# EAGLE schematic main_brd (EAGLE 9.2.2)
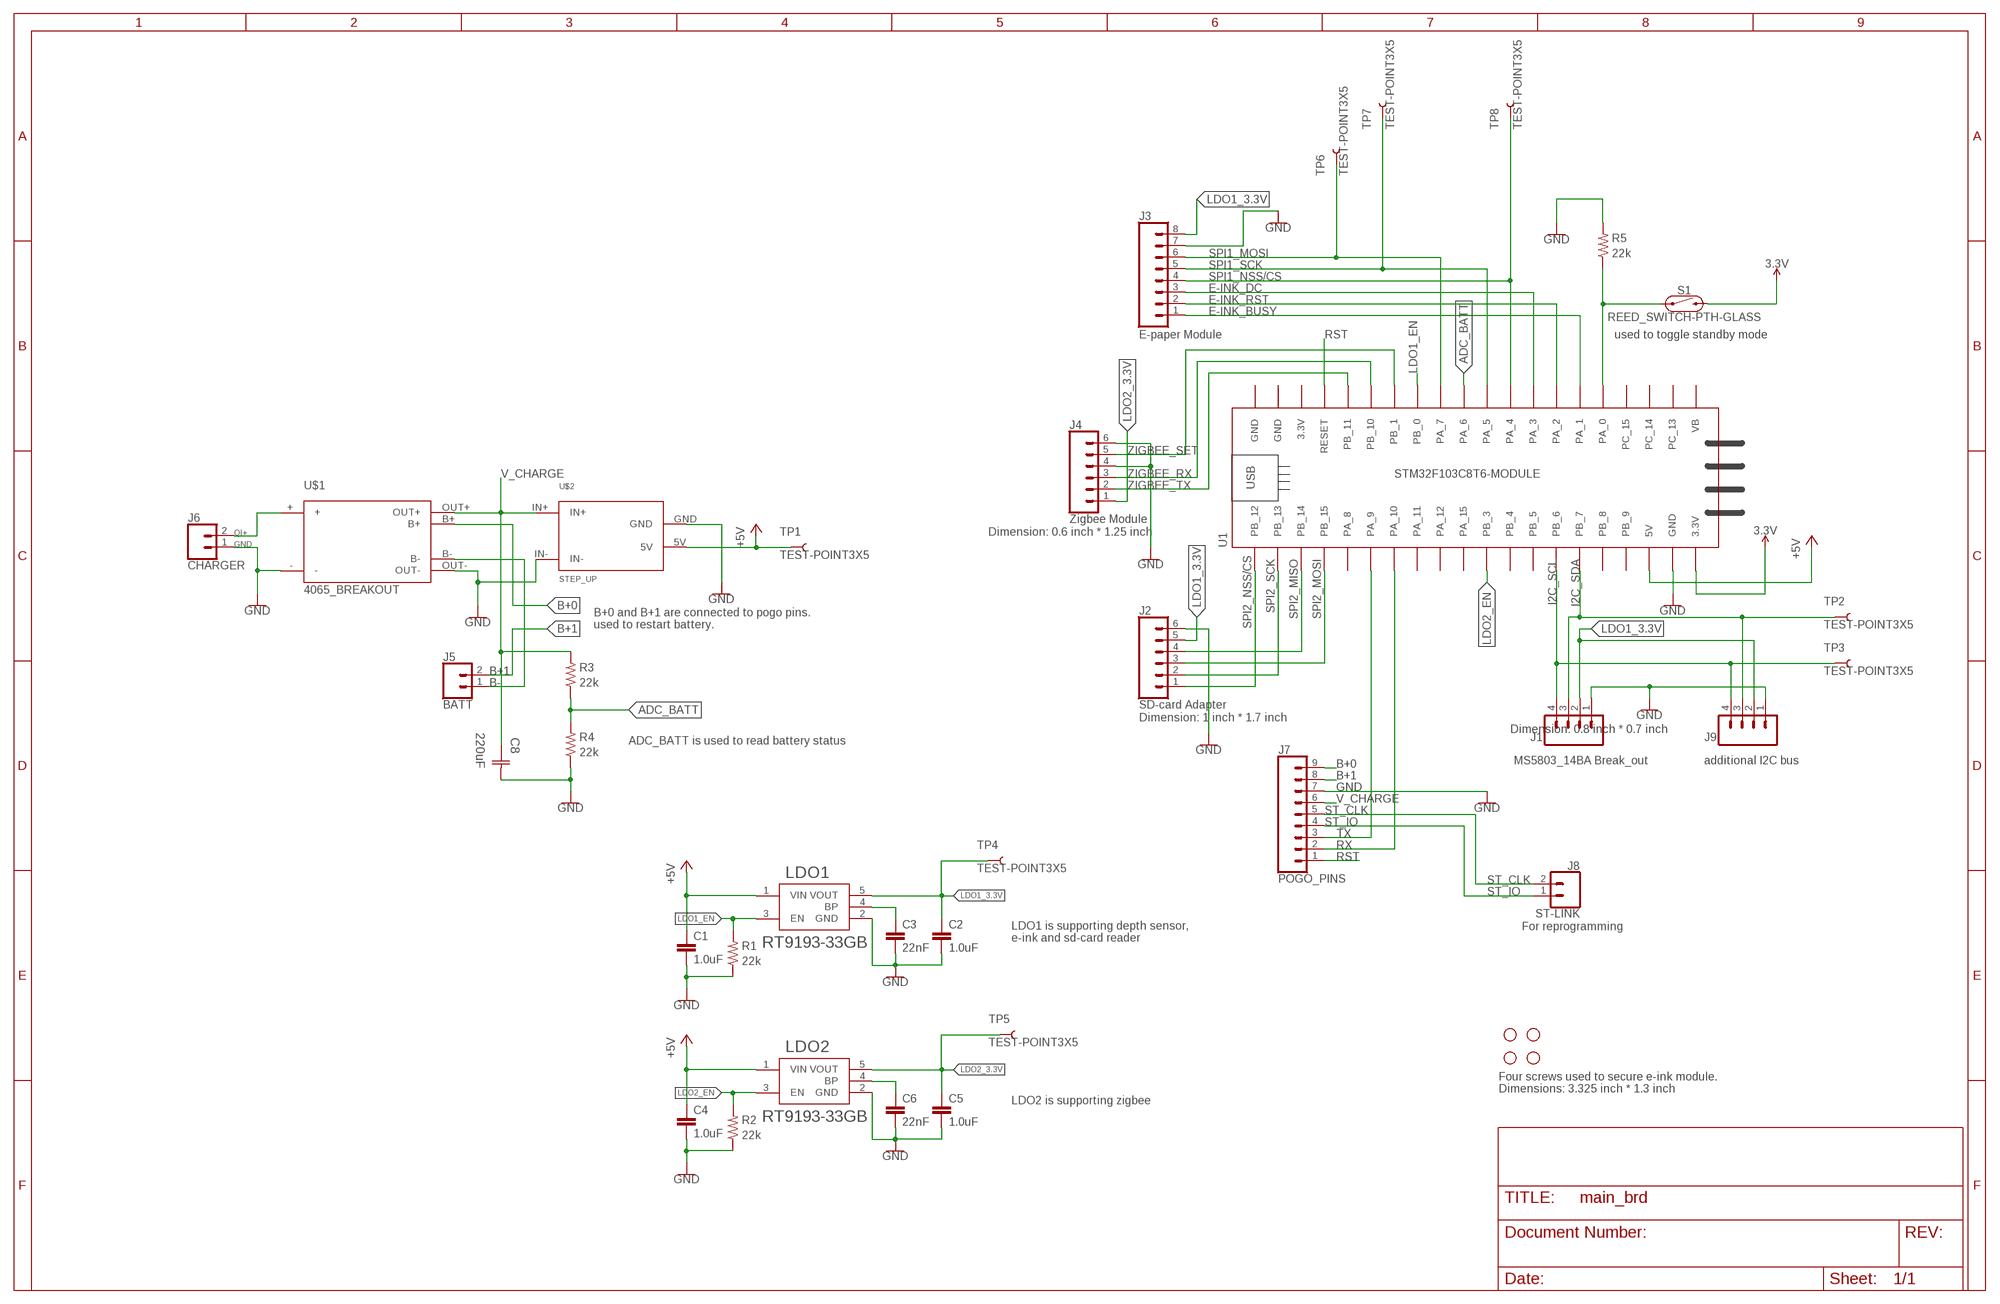
[diagram p0: schematic, sheet 1]

## Parts
C1  1.0uF  1.0UF-0603-16V-10%-X7R  [0603]
C2  1.0uF  1.0UF-0603-16V-10%-X7R  [0603]
C3  22nF  22NF/22,000PF-0603-50V-10%  [0603]
C4  1.0uF  1.0UF-0603-16V-10%-X7R  [0603]
C5  1.0uF  1.0UF-0603-16V-10%-X7R  [0603]
C6  22nF  22NF/22,000PF-0603-50V-10%  [0603]
C8  UWT1C221MCL1GSU2-K-M  [U2-K-M]
H1  STAND-OFFTIGHT  [STAND-OFF-TIGHT]
H2  STAND-OFFTIGHT  [STAND-OFF-TIGHT]
H3  STAND-OFFTIGHT  [STAND-OFF-TIGHT]
H4  STAND-OFFTIGHT  [STAND-OFF-TIGHT]
J1  MS5803_14BA Break_out  CONN_04PTH  [1X04]
J2  SD-card Adapter  CONN_06SILK_FEMALE_PTH  [1X06]
J3  E-paper Module  CONN_08"  [1X08]
J4  Zigbee Module  CONN_06SILK_FEMALE_PTH  [1X06]
J5  BATT  CONN_02  [1X02]
J6  CHARGER  CONN_02  [1X02]
J7  POGO_PINS  CONN_09  [1X09]
J8  ST-LINK  CONN_02  [1X02]
J9  additional I2C bus  CONN_04PTH  [1X04]
LDO1  RT9193-33GB  [SOT94P279X129-5N]
LDO2  RT9193-33GB  [SOT94P279X129-5N]
R1  22k  22KOHM-0603-1/10W-1%  [0603]
R2  22k  22KOHM-0603-1/10W-1%  [0603]
R3  22k  22KOHM-0603-1/10W-1%  [0603]
R4  22k  22KOHM-0603-1/10W-1%  [0603]
R5  22k  22KOHM-0603-1/10W-1%  [0603]
S1  REED_SWITCH-PTH-GLASS  [REED_SWITCH_GLASS]
TP1  TEST-POINT3X5  [PAD.03X.05]
TP2  TEST-POINT3X5  [PAD.03X.05]
TP3  TEST-POINT3X5  [PAD.03X.05]
TP4  TEST-POINT3X5  [PAD.03X.05]
TP5  TEST-POINT3X5  [PAD.03X.05]
TP6  TEST-POINT3X5  [PAD.03X.05]
TP7  TEST-POINT3X5  [PAD.03X.05]
TP8  TEST-POINT3X5  [PAD.03X.05]
U1  STM32F103C8T6-MODULE  [STM32F103C8T6-MODULE]
U$1  4065_BREAKOUT  [CHARGE_MODULE]
U$2  STEP_UP  [STEP_UP_99_69]

## Nets
3.3V: S1.P$2 U1.3.3V_1(3.3V)
+5V: C1.1 C4.1 LDO1.1(VIN) LDO2.1(VIN) TP1.P$1 U1.5V U$2.5V
ADC_BATT: R3.1 R4.2 U1.PA_6
B+0: J7.9 U$1.B+
B+1: J5.2 J7.8
B-: J5.1 U$1.B-
E-INK_BUSY: J3.1 U1.PA_1
E-INK_DC: J3.3 U1.PA_3
E-INK_RST: J3.2 U1.PA_2
GND: C1.2 C2.2 C3.2 C4.2 C5.2 C6.2 C8.2 J1.1 J2.6 J3.7 J4.4 J4.6 J6.1 J7.7 J9.1 LDO1.2(GND) LDO2.2(GND) R1.1 R2.1 R4.1 R5.2 U1.GND_1(GND) U$1.- U$1.OUT- U$2.GND U$2.IN-
I2C_SCL: J1.4 J9.4 TP3.P$1 U1.PB_6
I2C_SDA: J1.3 J9.3 TP2.P$1 U1.PB_7
LDO1_3.3V: C2.1 J1.2 J2.5 J3.8 J9.2 LDO1.5(VOUT) TP4.P$1
LDO1_EN: LDO1.3(EN) R1.2 U1.PB_0
LDO2_3.3V: C5.1 J4.1 LDO2.5(VOUT) TP5.P$1
LDO2_EN: LDO2.3(EN) R2.2 U1.PB_3
N$1: C6.1 LDO2.4(BP)
N$2: C3.1 LDO1.4(BP)
N$10: R5.1 S1.P$1 U1.PA_0
QI+: J6.2 U$1.+
RST: J7.1 U1.RESET
RX: J7.2 U1.PA_10
SPI1_MOSI: J3.6 TP6.P$1 U1.PA_7
SPI1_NSS/CS: J3.4 TP8.P$1 U1.PA_4
SPI1_SCK: J3.5 TP7.P$1 U1.PA_5
SPI2_MISO: J2.4 U1.PB_14
SPI2_MOSI: J2.3 U1.PB_15
SPI2_NSS/CS: J2.1 U1.PB_12
SPI2_SCK: J2.2 U1.PB_13
ST_CLK: J7.5 J8.2
ST_IO: J7.4 J8.1
TX: J7.3 U1.PA_9
V_CHARGE: C8.1 J7.6 R3.2 U$1.OUT+ U$2.IN+
ZIGBEE_RX: J4.3 U1.PB_10
ZIGBEE_SET: J4.5 U1.PB_1
ZIGBEE_TX: J4.2 U1.PB_11
Unconnected: U1.3.3V_2(3.3V) U1.GND_2(GND) U1.PA_8 U1.PA_11 U1.PA_12 U1.PA_15 U1.PB_4 U1.PB_5 U1.PB_8 U1.PB_9 U1.PC_13 U1.PC_14 U1.PC_15 U1.VB

## Notes on the sheet
- E-paper Module | used to toggle standby mode
- Dimension: 0.6 inch * 1.25 inch
- B+0 and B+1 are connected to pogo pins.
  used to restart battery.
- Dimension: 1 inch * 1.7 inch
- Dimension: 0.8 inch * 0.7 inch
- ADC_BATT is used to read battery status
- For reprogramming
- LDO1 is supporting depth sensor, 
  e-ink and sd-card reader
- Four screws used to secure e-ink module.
  Dimensions: 3.325 inch * 1.3 inch
- LDO2 is supporting zigbee

## Power pins joined to a net without a drawn wire
GND: U1.GND_3(GND)

## Library data of the parts
C1 C2 C4 C5 = SparkFun-Capacitors:1.0UF: 1µF ceramic capacitors A capacitor is a passive two-terminal electrical component used to store electrical energy temporarily in an electric field.; PROD_ID: CAP-13930
C3 C6 = SparkFun-Capacitors:22NF/22,000PF: 0.022uF/22nF/22,000pF ceramic capacitors A capacitor is a passive two-terminal electrical component used to store electrical energy temporarily in an electric field.; PROD_ID: CAP-07885
C8 = capacitor_220uF:UWT1C221MCL1GS; MANUFACTURER_PART_NUMBER: UWT1C221MCL1GS; VENDOR: Nichicon
H1-H4 = SparkFun-Hardware:STAND-OFF: Stand Off Drill holes for mechanically mounting via screws, standoffs, etc. Note: Use the keepout ring to avoid running the screw head into surrounding components. Variant Overviews STAND-OFF - Mechanical footprint for a #4 phillips button head screw. STAND-OFF-TIGHT - Mechanical footprint for a #4 phillips button head screw, Example SparkFun Products Screw - Phillips Head (1/4", 4-40, 10 pack) <https://www.sparkfun.com/products/10453> (PRT-10453) Screw - Phillips Head (1/2", 4-40, 10 pack) <https://www.sparkfun.com/products/10452> (PRT-10452) Screw - Phillips Head (3/4", 4-40, 10 pack) <https://www.sparkfun.com/products/10451> (PRT-10451) Screw - Phillips Head (1", 4-40, 10 pack) <https://www.sparkfun.com/products/10450> (PRT-10450)
J1 J9 = SparkFun-Connectors:CONN_04: Multi connection point. Often used as Generic Header-pin footprint for 0.1 inch spaced/style header connections On any of the 0.1 inch spaced packages, you can populate with these: Break Away Headers - Straight <https://www.sparkfun.com/products/116> (PRT-00116) Break Away Male Headers - Right Angle <https://www.sparkfun.com/products/553> (PRT-00553) Female Headers <https://www.sparkfun.com/products/115> (PRT-00115) Break Away Headers - Machine Pin <https://www.sparkfun.com/products/117> (PRT-00117) Break Away Female Headers - Swiss Machine Pin <https://www.sparkfun.com/products/743> (PRT-00743) For SCREWTERMINALS and SPRING TERMINALS visit here: Screw Terimnals on SparkFun.com <https://www.sparkfun.com/search/results?term=Screw+Terminals> (5mm/3.5mm/2.54mm spacing) This device is also useful as a general connection point to wire up your design to another part of your project. Our various solder wires solder well into these plated through hole pads. Hook-Up Wire - Assortment (Stranded, 22 AWG) <https://www.sparkfun.com/products/11375> (PRT-11375) Hook-Up Wire - Assortment (Solid Core, 22 AWG) <https://www.sparkfun.com/products/11367> (PRT-11367) View the entire wire category on our website here <https://www.sparkfun.com/categories/141> Special notes: Molex polarized connector foot print use with SKU : PRT-08231 with associated crimp pins and housings. 1MM SMD Version SKU: PRT-10208; PROD_ID: CONN-09696
J2 J4 = SparkFun-Connectors:CONN_06: Multi connection point. Often used as Generic Header-pin footprint for 0.1 inch spaced/style header connections On any of the 0.1 inch spaced packages, you can populate with these: Break Away Headers - Straight <https://www.sparkfun.com/products/116> (PRT-00116) Break Away Male Headers - Right Angle <https://www.sparkfun.com/products/553> (PRT-00553) Female Headers <https://www.sparkfun.com/products/115> (PRT-00115) Break Away Headers - Machine Pin <https://www.sparkfun.com/products/117> (PRT-00117) Break Away Female Headers - Swiss Machine Pin <https://www.sparkfun.com/products/743> (PRT-00743) Arduino Stackable Header - 6 Pin <https://www.sparkfun.com/products/9280> (PRT-09280) For SCREWTERMINALS and SPRING TERMINALS visit here: Screw Terimnals on SparkFun.com <https://www.sparkfun.com/search/results?term=Screw+Terminals> (5mm/3.5mm/2.54mm spacing) This device is also useful as a general connection point to wire up your design to another part of your project. Our various solder wires solder well into these plated through hole pads. Hook-Up Wire - Assortment (Stranded, 22 AWG) <https://www.sparkfun.com/products/11375> (PRT-11375) Hook-Up Wire - Assortment (Solid Core, 22 AWG) <https://www.sparkfun.com/products/11367> (PRT-11367) View the entire wire category on our website here <https://www.sparkfun.com/categories/141>; PROD_ID: CONN-08437
J3 = SparkFun-Connectors:CONN_08: Multi connection point. Often used as Generic Header-pin footprint for 0.1 inch spaced/style header connections On any of the 0.1 inch spaced packages, you can populate with these: Break Away Headers - Straight <https://www.sparkfun.com/products/116> (PRT-00116) Break Away Male Headers - Right Angle <https://www.sparkfun.com/products/553> (PRT-00553) Female Headers <https://www.sparkfun.com/products/115> (PRT-00115) Break Away Headers - Machine Pin <https://www.sparkfun.com/products/117> (PRT-00117) Break Away Female Headers - Swiss Machine Pin <https://www.sparkfun.com/products/743> (PRT-00743) Arduino Stackable Header - 8 Pin <https://www.sparkfun.com/products/9279> (PRT-09279) For SCREWTERMINALS and SPRING TERMINALS visit here: Screw Terimnals on SparkFun.com <https://www.sparkfun.com/search/results?term=Screw+Terminals> (5mm/3.5mm/2.54mm spacing) This device is also useful as a general connection point to wire up your design to another part of your project. Our various solder wires solder well into these plated through hole pads. Hook-Up Wire - Assortment (Stranded, 22 AWG) <https://www.sparkfun.com/products/11375> (PRT-11375) Hook-Up Wire - Assortment (Solid Core, 22 AWG) <https://www.sparkfun.com/products/11367> (PRT-11367) View the entire wire category on our website here <https://www.sparkfun.com/categories/141> Special notes: Molex polarized connector foot print use with SKU : PRT-08231 with associated crimp pins and housings. 1MM SMD Version SKU: PRT-10208 NOTES ON THE VARIANTS LOCK and LOCK_LONGPADS... This footprint was designed to help hold the alignment of a through-hole component (i.e. 6-pin header) while soldering it into place. You may notice that each hole has been shifted either up or down by 0.005 of an inch from it's more standard position (which is a perfectly straight line). This slight alteration caused the pins (the squares in the middle) to touch the edges of the holes. Because they are alternating, it causes a "brace" to hold the component in place. 0.005 has proven to be the perfect amount of "off-center" position when using our standard breakaway headers. Although looks a little odd when you look at the bare footprint, once you have a header in there, the alteration is very hard to notice. Also,if you push a header all the way into place, it is covered up entirely on the bottom side.; PROD_ID: CONN-08438
J5 J6 J8 = SparkFun-Connectors:CONN_02: Multi connection point. Often used as Generic Header-pin footprint for 0.1 inch spaced/style header connections On any of the 0.1 inch spaced packages, you can populate with these: Break Away Headers - Straight <https://www.sparkfun.com/products/116> (PRT-00116) Break Away Male Headers - Right Angle <https://www.sparkfun.com/products/553> (PRT-00553) Female Headers <https://www.sparkfun.com/products/115> (PRT-00115) Break Away Headers - Machine Pin <https://www.sparkfun.com/products/117> (PRT-00117) Break Away Female Headers - Swiss Machine Pin <https://www.sparkfun.com/products/743> (PRT-00743) For SCREWTERMINALS and SPRING TERMINALS visit here: Screw Terimnals on SparkFun.com <https://www.sparkfun.com/search/results?term=Screw+Terminals> (5mm/3.5mm/2.54mm spacing) This device is also useful as a general connection point to wire up your design to another part of your project. Our various solder wires solder well into these plated through hole pads. Hook-Up Wire - Assortment (Stranded, 22 AWG) <https://www.sparkfun.com/products/11375> (PRT-11375) Hook-Up Wire - Assortment (Solid Core, 22 AWG) <https://www.sparkfun.com/products/11367> (PRT-11367) View the entire wire category on our website here <https://www.sparkfun.com/categories/141> Special notes: Molex polarized connector foot print use with: PRT-08233 with associated crimp pins and housings. 2.54_SCREWTERM for use with PRT-10571. 3.5mm Screw Terminal footprints for PRT-08084 5mm Screw Terminal footprints for use with PRT-08432
J7 = SparkFun-Connectors:CONN_09: Multi connection point. Often used as Generic Header-pin footprint for 0.1 inch spaced/style header connections On any of the 0.1 inch spaced packages, you can populate with these: Break Away Headers - Straight <https://www.sparkfun.com/products/116> (PRT-00116) Break Away Male Headers - Right Angle <https://www.sparkfun.com/products/553> (PRT-00553) Female Headers <https://www.sparkfun.com/products/115> (PRT-00115) Break Away Headers - Machine Pin <https://www.sparkfun.com/products/117> (PRT-00117) Break Away Female Headers - Swiss Machine Pin <https://www.sparkfun.com/products/743> (PRT-00743) For SCREWTERMINALS and SPRING TERMINALS visit here: Screw Terimnals on SparkFun.com <https://www.sparkfun.com/search/results?term=Screw+Terminals> (5mm/3.5mm/2.54mm spacing) This device is also useful as a general connection point to wire up your design to another part of your project. Our various solder wires solder well into these plated through hole pads. Hook-Up Wire - Assortment (Stranded, 22 AWG) <https://www.sparkfun.com/products/11375> (PRT-11375) Hook-Up Wire - Assortment (Solid Core, 22 AWG) <https://www.sparkfun.com/products/11367> (PRT-11367) View the entire wire category on our website here <https://www.sparkfun.com/categories/141> Special notes: Molex polarized connector foot print use with SKU : PRT-08231 with associated crimp pins and housings. 1MM SMD Version SKU: PRT-10208 NOTES ON THE VARIANTS LOCK and LOCK_LONGPADS... This footprint was designed to help hold the alignment of a through-hole component (i.e. 6-pin header) while soldering it into place. You may notice that each hole has been shifted either up or down by 0.005 of an inch from it's more standard position (which is a perfectly straight line). This slight alteration caused the pins (the squares in the middle) to touch the edges of the holes. Because they are alternating, it causes a "brace" to hold the component in place. 0.005 has proven to be the perfect amount of "off-center" position when using our standard breakaway headers. Although looks a little odd when you look at the bare footprint, once you have a header in there, the alteration is very hard to notice. Also,if you push a header all the way into place, it is covered up entirely on the bottom side.
LDO1 LDO2 = RT9193-33GB:RT9193-33GB: RT9193 Series 300 mA 3.3 V Ultra-Low Noise Ultra-Fast CMOS LDO Regulator-SC-70-5; DESCRIPTION: RT9193 Series 300 mA 3.3 V Ultra-Low Noise Ultra-Fast CMOS LDO Regulator-SC-70-5; DIGI-KEY_PART_NUMBER: 1028-1014-1-ND; DIGI-KEY_PURCHASE_URL: https://www.digikey.com/product-detail/en/richtek-usa-inc/RT9193-33GB/1028-1014-1-ND/2470073?utm_source=snapeda&utm_medium=aggregator&utm_campaign=symbol; MF: Richtek USA; MP: RT9193-33GB; PACKAGE: SOT-23-5 Richtek
R1-R5 = SparkFun-Resistors:22KOHM: 22kΩ resistor A resistor is a passive two-terminal electrical component that implements electrical resistance as a circuit element. Resistors act to reduce current flow, and, at the same time, act to lower voltage levels within circuits. - Wikipedia; PROD_ID: RES-07853
S1 = SparkFun-Switches:REED_SWITCH: Reed Switch A reed switch is a magnetically-actuated switch. When the device is exposed to a magnetic field, the two ferrous materials inside the switch pull together and the switch closes. Variant Overview PTH-GLASS Reed Switch <https://www.sparkfun.com/products/8642> (COM-08642) - PTH reed switch w/ glass body (6.0 x 0.9 mm) PTH-INSULATED Reed Switch - Insulated <https://www.sparkfun.com/products/10601> (COM-10601) - PTH reed switch w/ insulated body (15.1 x 4.2 mm); PROD_ID: SWCH-09282; SF_SKU: COM-08642
TP1-TP8 = SparkFun-Connectors:TEST-POINT: SparkFun Test Points Bare copper test points for troubleshooting or In-Circuit-Testing. These are used by our Production team for verifying production board runs using pogo-pins on test beds. SparkFun Products: SparkFun LSM9DS1 Breakout <https://www.sparkfun.com/products/13284> SparkFun PSOC <https://www.sparkfun.com/products/13714> SparkFun Load Cell Amplifier <https://www.sparkfun.com/products/13879>
U1 = stm32f103c8t6_module:STM32F103C8T6-MODULE: STM32F103C8T6 module with ARM Cortex-3, 20kB SRAM, 64kB Flash, 72MHz
U$1 = coral_power:4065_BREAKOUT: TP4056 Micro USB 5V 1A 18650 Lithium Battery Charger Board, with Overcharge Over-Discharge Over-Current Protection
U$2 = coral_power:STEP_UP: Mini DC to DC Voltage Regulator Step Up Boost Converter Power Supply Module 1V-5V to 5V 500mA

## Module 123
Ports: 

### Library data of the parts